# EasyEDA Pro project esp12.eprj

# Schematic Schematic1
Create Date: 2022-09-19; Page Name: P1; Project Name: esp12; Schematic Name: Schematic1; Update Date: 2023-09-01; Company: EasyEDA.com; Drawed: EasyEDA Pro; Page Size: A4; Part Number: JLCPCB-002; Reviewed: EasyEDA Pro; Version: V0.1
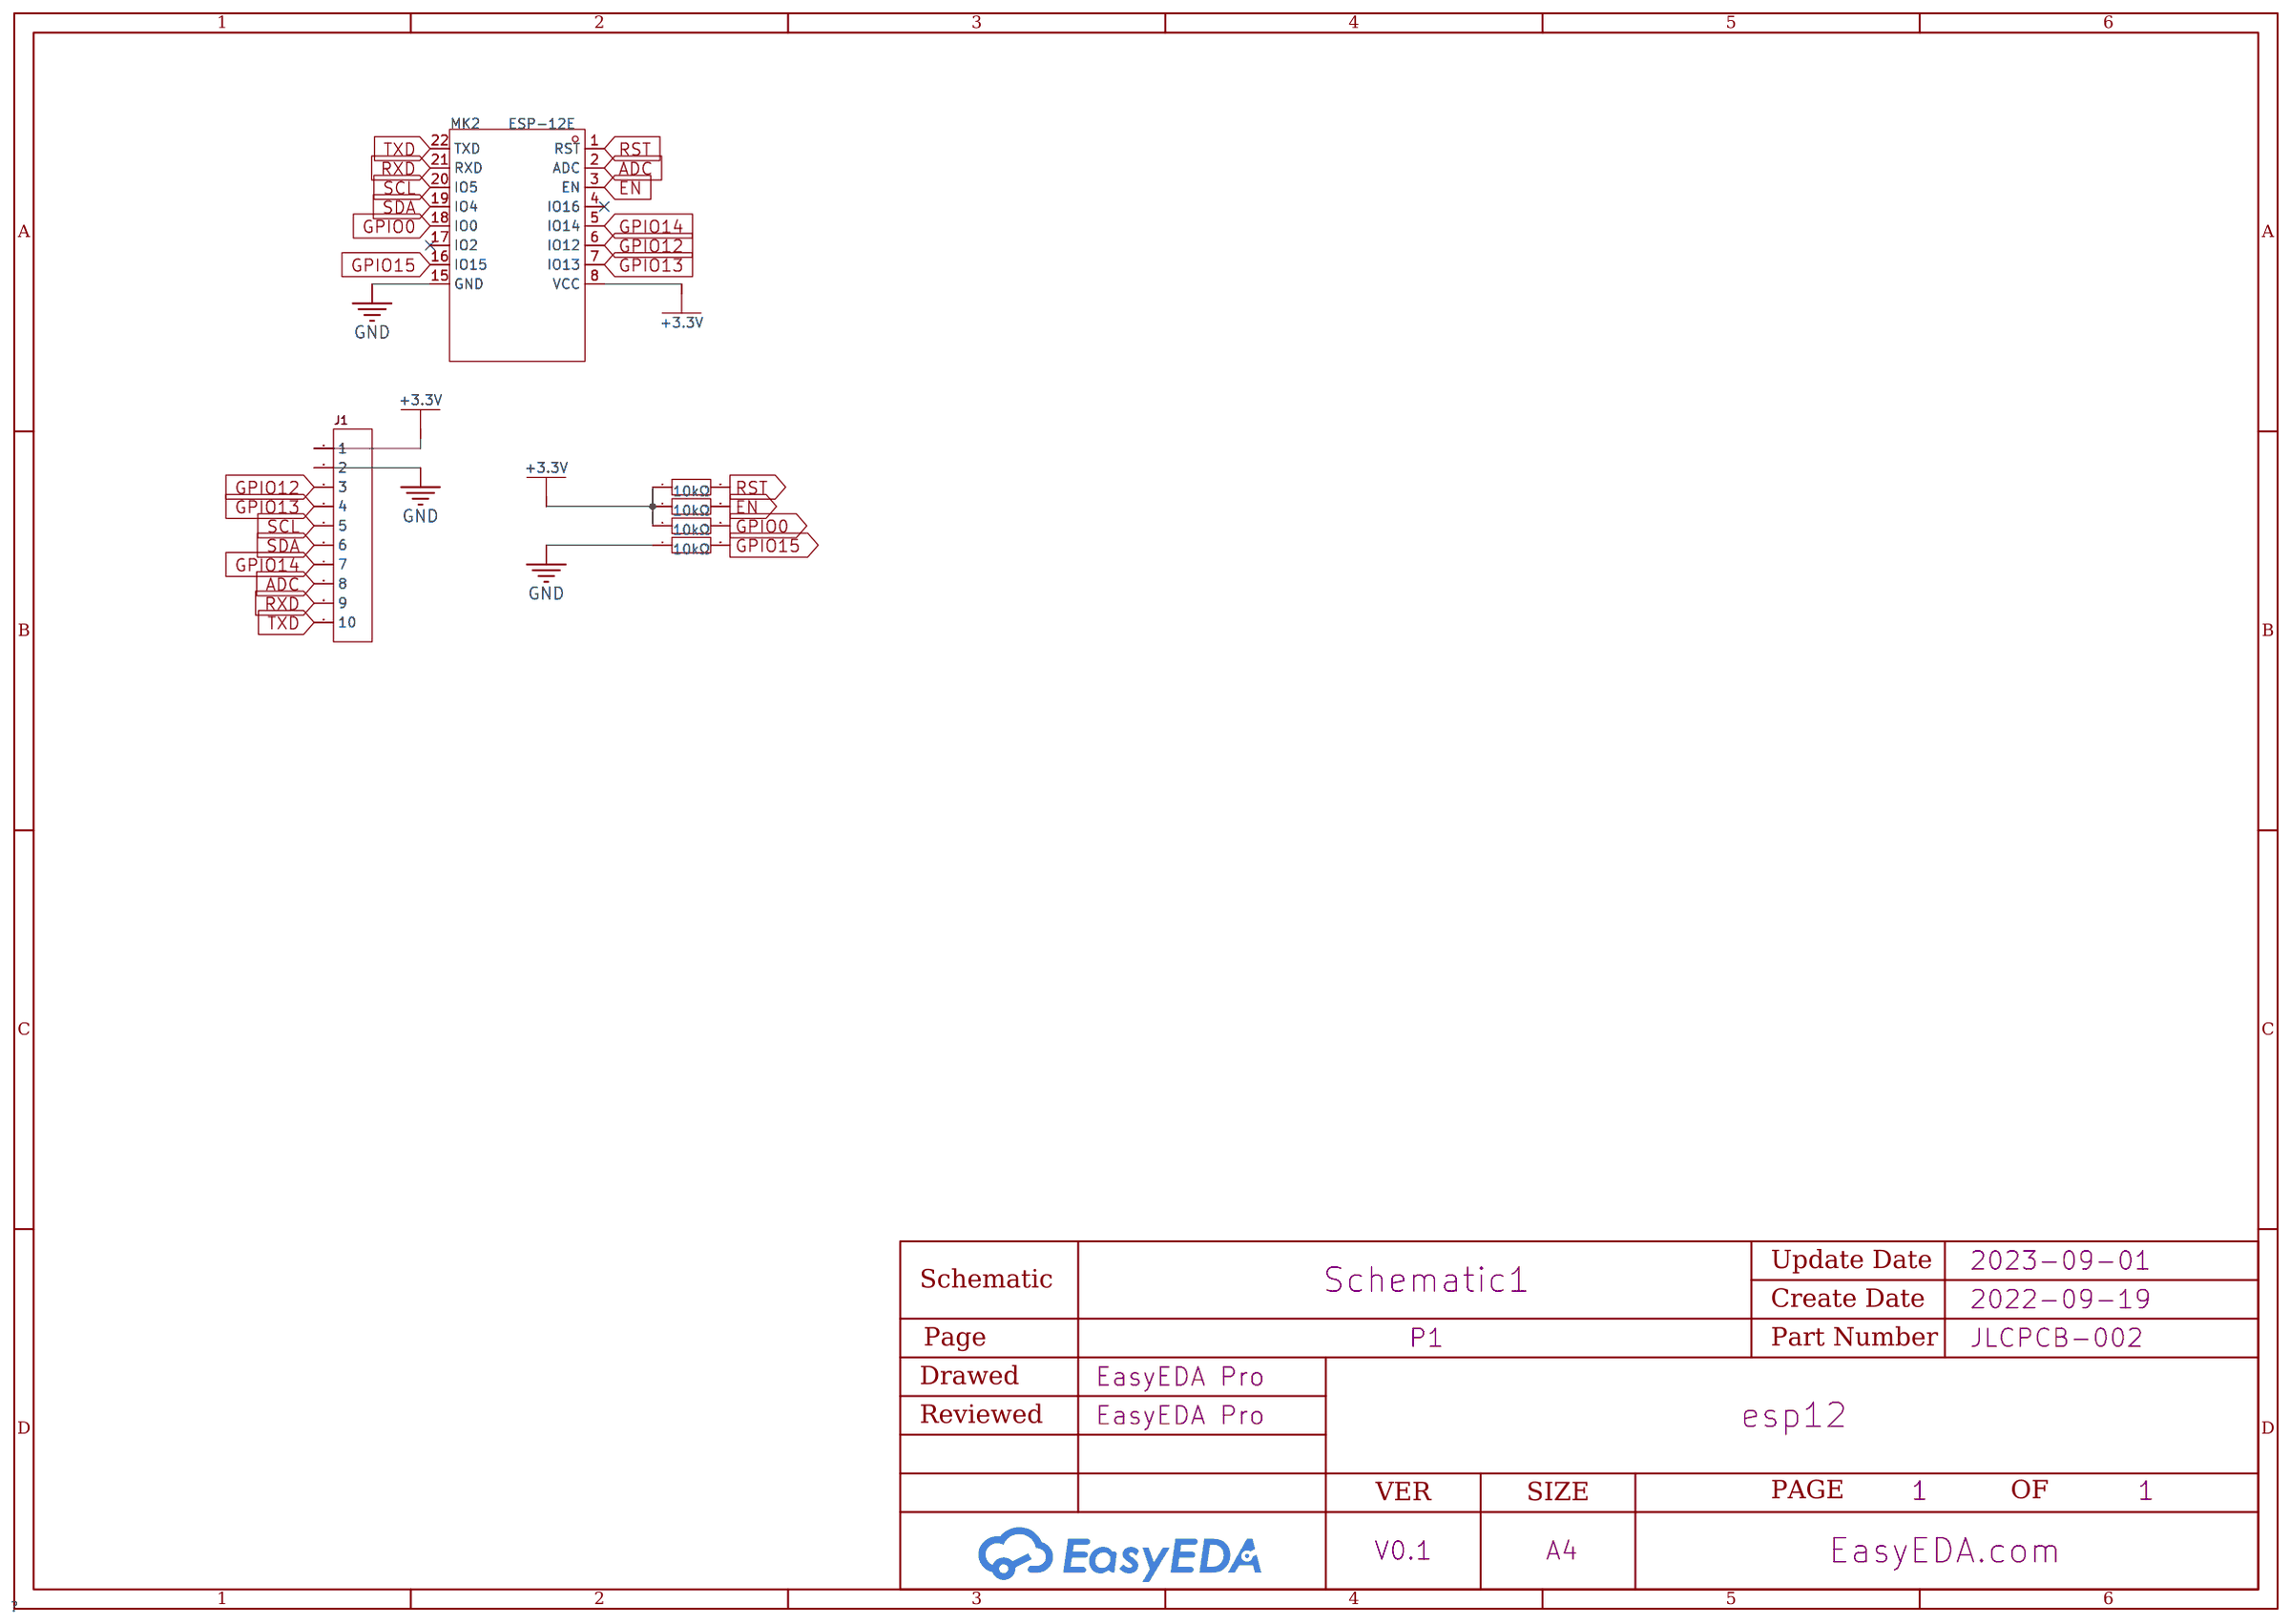
[diagram p0: schematic sheet]

## Parts
J1  HDR-M-2.54_1x10  [HDR-TH_10P-P2.54-V-F-R2-C5-S2.54-4]
MK2  ESP-12E  [WIFIM-SMD_ESP-12E-BR]
R4  10kΩ  [R0603]
R5  10kΩ  [R0603]
R6  10kΩ  [R0603]
R7  10kΩ  [R0603]

## Library data of the parts
J1 = HDR-M-2.54_1x10: Supplier Part: C57369; Supplier: LCSC
MK2 = ESP-12E_C89297: Supplier Part: C89297; Manufacturer: Ai-Thinker(安信可); Supplier Footprint: 无线模块(WIFI); JLCPCB Part Class: Extended Part; Datasheet: https://atta.szlcsc.com/upload/public/pdf/source/20161125/1480068346912.pdf; Supplier: LCSC
R4-R7 = RC0603JR-0710KL: Overload Voltage (Max): Resistance: Body Length:- Tolerance: φD:- Body Height:- Body Width:- Type:Thick Film Resistors Temperature Coefficient: Temperature Coefficient: Operating Temperature Range: Operating Temperature Range: Power(Watts):; LCSC Part Name: 10kΩ ±5%; Supplier Part: C99198; Manufacturer: YAGEO(国巨); Supplier Footprint: 0603; JLCPCB Part Class: Extended Part; Datasheet: https://atta.szlcsc.com/upload/public/pdf/source/20181223/C99198_917934A193F41F77D9F7D214A8C79116.pdf; Supplier: LCSC; Type: Thick Film Resistors

## Nets
+3.3V: J1.1 MK2.8(VCC) R4.1 R5.1 R6.1
GND: J1.2 MK2.15(GND) R7.1
ADC: J1.8 MK2.2(ADC)
EN: MK2.3(EN) R6.2
GPIO0: MK2.18(IO0) R4.2
GPIO12: J1.3 MK2.6(IO12)
GPIO13: J1.4 MK2.7(IO13)
GPIO14: J1.7 MK2.5(IO14)
GPIO15: MK2.16(IO15) R7.2
RST: MK2.1(RST) R5.2
RXD: J1.9 MK2.21(RXD)
SCL: J1.5 MK2.20(IO5)
SDA: J1.6 MK2.19(IO4)
TXD: J1.10 MK2.22(TXD)

Not connected (* = marked no-connect by the designer): MK2 4(IO16)* 17(IO2)*

# Schematic Schematic3
Create Date: 2022-12-06; Page Name: P1; Project Name: esp12; Schematic Name: Schematic3; Update Date: 2023-01-08; Company: EasyEDA.com; Drawed: EasyEDA Pro; Page Size: A4; Part Number: JLCPCB-002; Reviewed: EasyEDA Pro; Version: V0.1
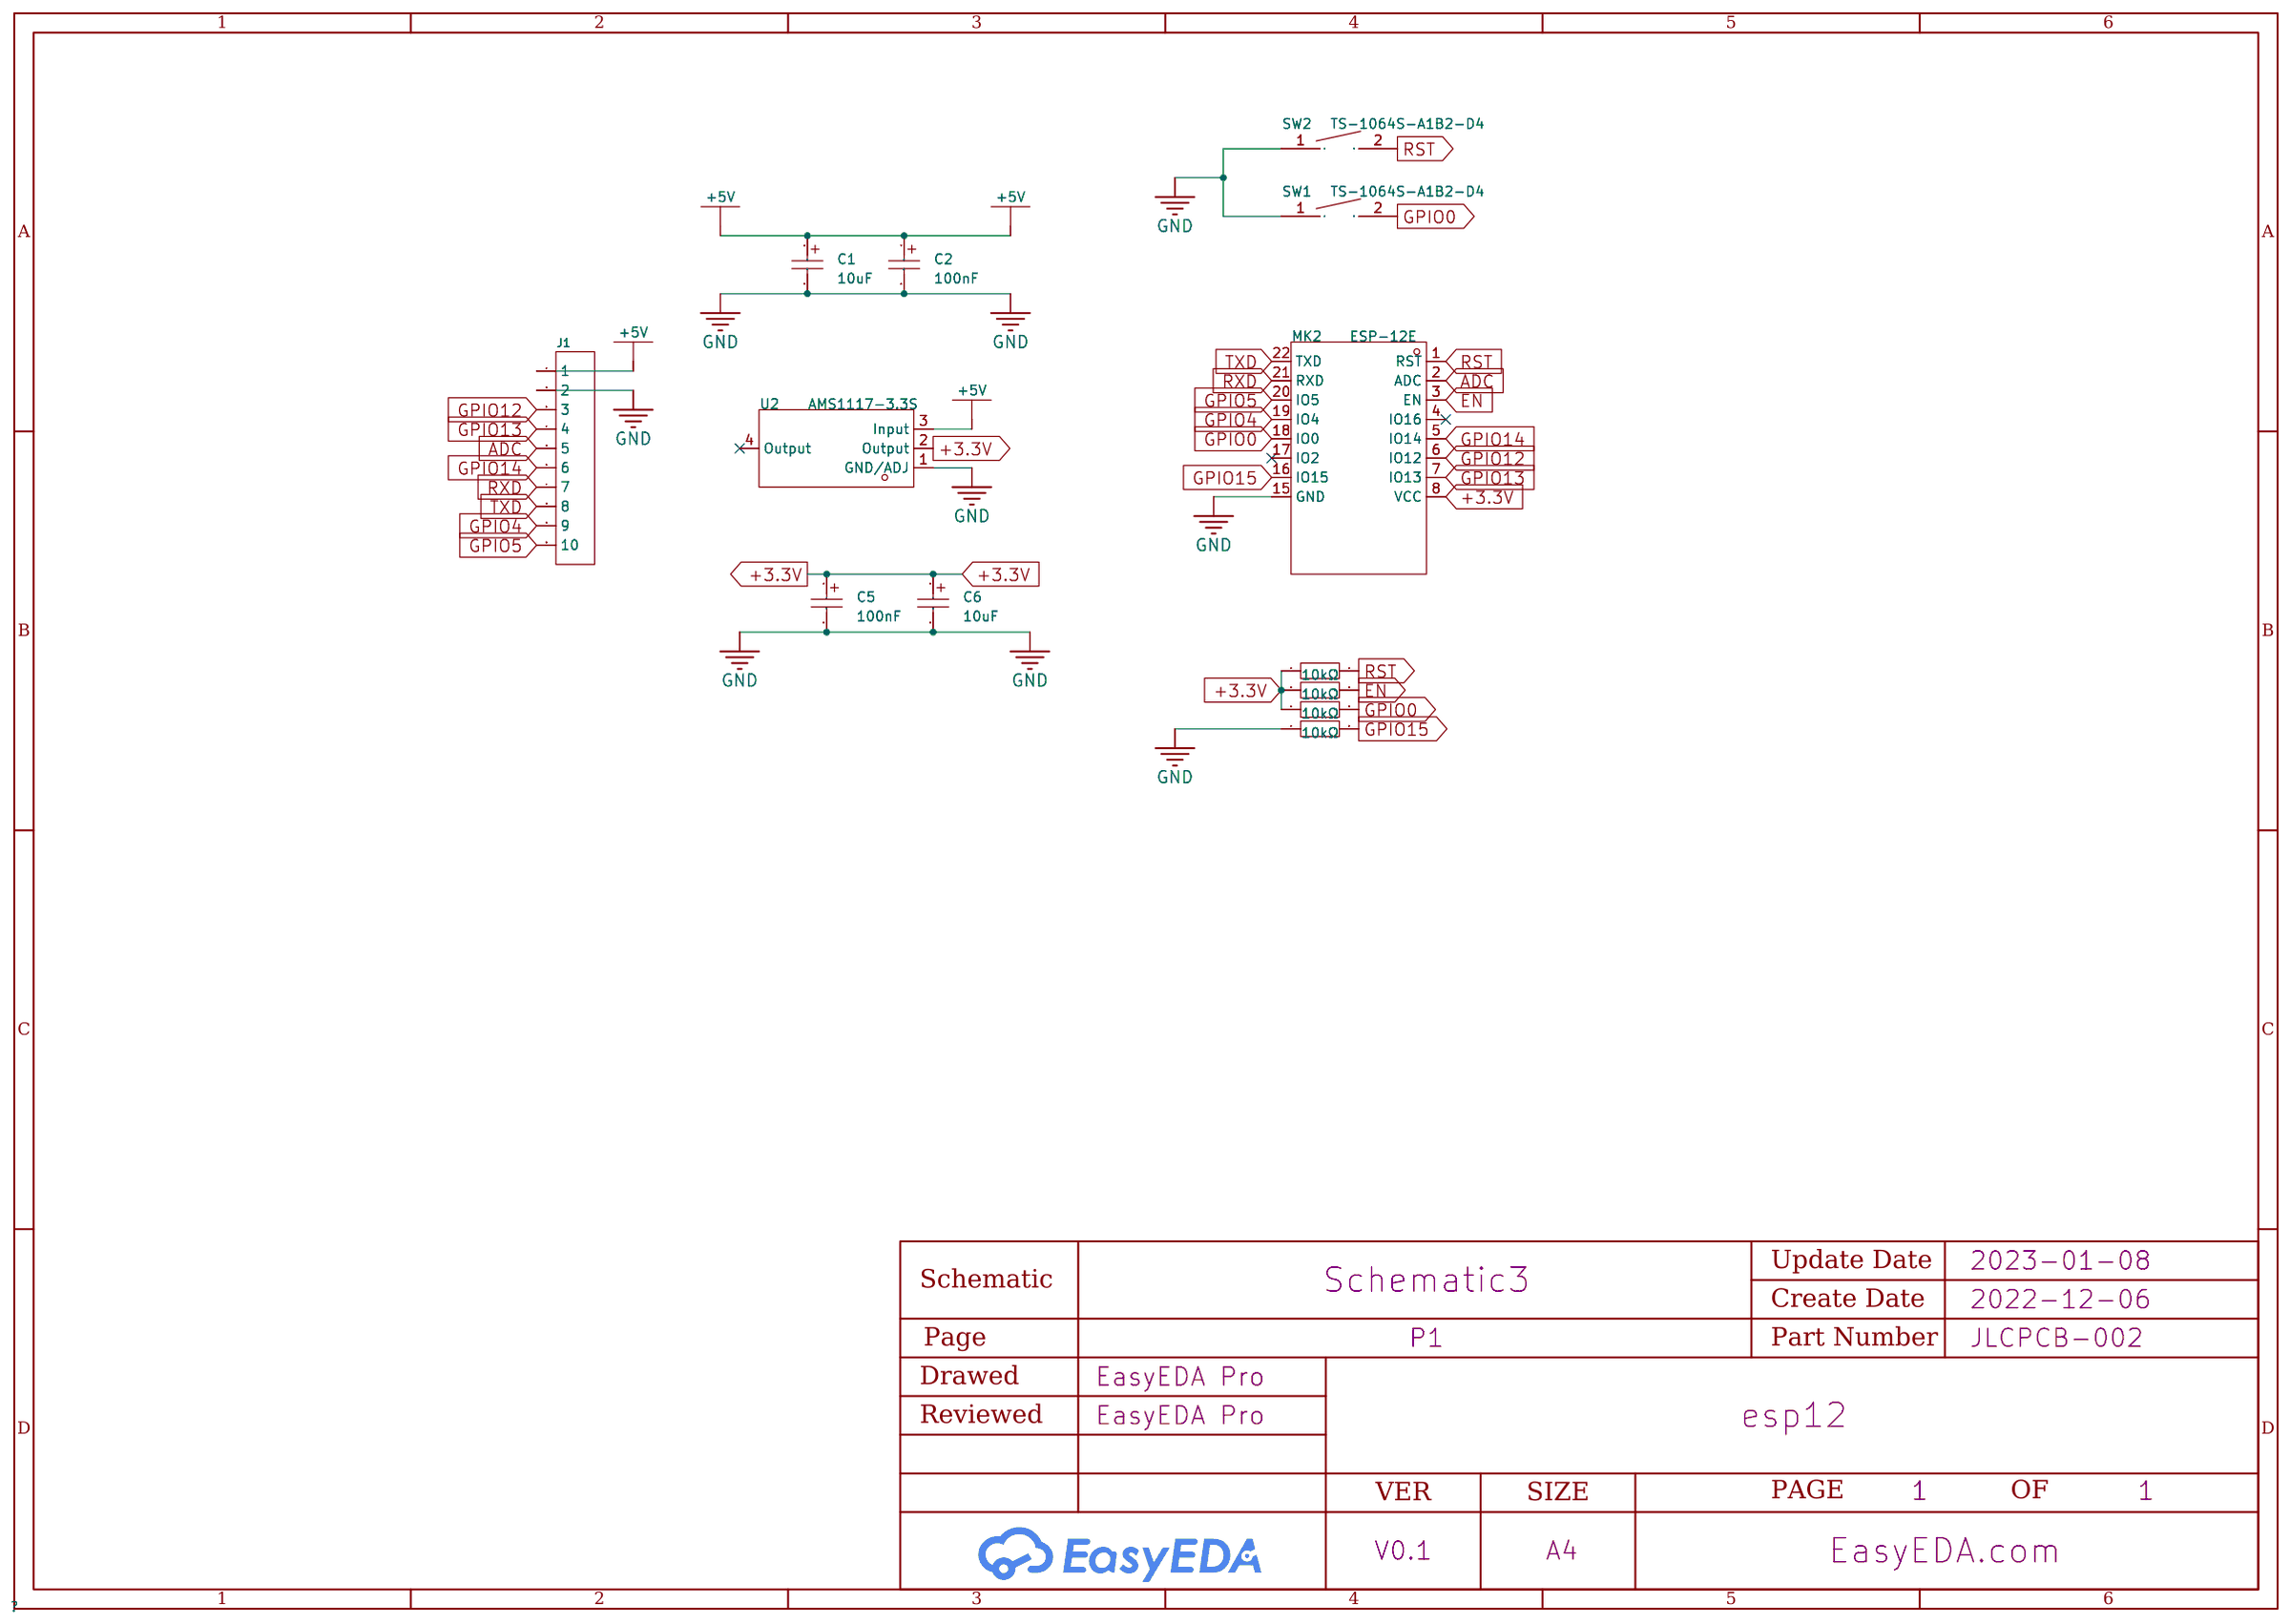
[diagram p1: schematic sheet]

## Parts
C1  10uF  [CAP-SMD_L3.2-W1.6-RD]
C2  100nF  [CAP-SMD_L3.2-W1.6]
C5  100nF  [CAP-SMD_L3.2-W1.6]
C6  10uF  [CAP-SMD_L3.2-W1.6-RD]
J1  HDR-M-2.54_1x10  [HDR-TH_10P-P2.54-V-F-R2-C5-S2.54-4]
MK2  ESP-12E  [WIFIM-SMD_ESP-12E-BR]
R1  10kΩ  [R0603]
R2  10kΩ  [R0603]
R3  10kΩ  [R0603]
R4  10kΩ  [R0603]
SW1  TS-1064S-A1B2-D4  [KEY-SMD_L3.0-W2.5-LS4.0]
SW2  TS-1064S-A1B2-D4  [KEY-SMD_L3.0-W2.5-LS4.0]
U2  AMS1117-3.3S  [SOT-223-4_L6.5-W3.5-P2.30-LS7.0-BL]

## Library data of the parts
C1 C6 = TAJA106K010RNJ: Capacitance: Tolerance:±10% Tolerance:±10% Rated Voltage: Equivalent Series Resistance(ESR):3Ω@100kHz Operating Temperature:-55~+125 Operating Temperature:-55~+125; LCSC Part Name: 10uF ±10% 10V; Supplier Part: C7177; Manufacturer: Kyocera AVX; Supplier Footprint: CASE-A_3216; JLCPCB Part Class: Extended Part; Datasheet: https://atta.szlcsc.com/upload/public/pdf/source/20160107/1457707748330.pdf; Supplier: LCSC; Tolerance: ±10%; Equivalent Series Resistance(ESR): 3Ω@100kHz; Operating Temperature: -55~+125
C2 C5 = TAJA104K035RNJ: Capacitance: Tolerance:±10% Tolerance:±10% Rated Voltage: Equivalent Series Resistance(ESR):24Ω@100kHz Operating Temperature:-55~+125 Operating Temperature:-55~+125; LCSC Part Name: 100nF ±10% 35V; Supplier Part: C7173; Manufacturer: Kyocera AVX; Supplier Footprint: CASE-A_3216; JLCPCB Part Class: Extended Part; Datasheet: https://atta.szlcsc.com/upload/public/pdf/source/20160107/1457707748183.pdf; Supplier: LCSC; Tolerance: ±10%; Equivalent Series Resistance(ESR): 24Ω@100kHz; Operating Temperature: -55~+125
J1 = HDR-M-2.54_1x10: Supplier Part: C57369; Supplier: LCSC
MK2 = ESP-12E_C89297: Supplier Part: C89297; Manufacturer: Ai-Thinker(安信可); Supplier Footprint: 无线模块(WIFI); JLCPCB Part Class: Extended Part; Datasheet: https://atta.szlcsc.com/upload/public/pdf/source/20161125/1480068346912.pdf; Supplier: LCSC
R1-R4 = RC0603JR-0710KL: Overload Voltage (Max): Resistance: Body Length:- Tolerance: φD:- Body Height:- Body Width:- Type:Thick Film Resistors Temperature Coefficient: Temperature Coefficient: Operating Temperature Range: Operating Temperature Range: Power(Watts):; LCSC Part Name: 10kΩ ±5%; Supplier Part: C99198; Manufacturer: YAGEO(国巨); Supplier Footprint: 0603; JLCPCB Part Class: Extended Part; Datasheet: https://atta.szlcsc.com/upload/public/pdf/source/20181223/C99198_917934A193F41F77D9F7D214A8C79116.pdf; Supplier: LCSC; Type: Thick Film Resistors
SW1 SW2 = TS-1064S-A1B2-D4: Circuit:SPST Mounting Style:Brick nogging Actuator Style:Round Button With Lamp:- Operating Force:180gf@±30gf Switch Length:3mm Switch Width:2.5mm Switch Height:1.5mm; LCSC Part Name: 轻触开关3.0*2.5*1.5正按贴片小小龟180gf; Supplier Part: C498294; Manufacturer: Yuandi(台湾元迪); Supplier Footprint: SMD,3x2.5x1.5mm; JLCPCB Part Class: Extended Part; Datasheet: https://atta.szlcsc.com/upload/public/pdf/source/20200318/C498294_666F8F3E87612379939888B0D532704B.pdf; Supplier: LCSC; Circuit: SPST; Mounting Style: Brick nogging; Actuator Style: Round Button; Operating Force: 180gf@±30gf; Switch Length: 3mm; Switch Width: 2.5mm; Switch Height: 1.5mm
U2 = AMS1117-3.3S: Supplier Part: C2842296; Manufacturer: KEXIN(科信); Supplier Footprint: SOT-223; JLCPCB Part Class: Extended Part; Datasheet: https://atta.szlcsc.com/upload/public/pdf/source/20220119/687E7B65F4F54F278E2F75AE3BEEDBF9.pdf; Supplier: LCSC

## Nets
+3.3V: C5.1 C6.1 MK2.8(VCC) R1.1 R2.1 R4.1 U2.2(Output)
+5V: C1.1 C2.1 J1.1 U2.3(Input)
GND: C1.2 C2.2 C5.2 C6.2 J1.2 MK2.15(GND) R3.1 SW1.1 SW2.1 U2.1(GND/ADJ)
ADC: J1.5 MK2.2(ADC)
EN: MK2.3(EN) R2.2
GPIO0: MK2.18(IO0) R4.2 SW1.2
GPIO4: J1.9 MK2.19(IO4)
GPIO5: J1.10 MK2.20(IO5)
GPIO12: J1.3 MK2.6(IO12)
GPIO13: J1.4 MK2.7(IO13)
GPIO14: J1.6 MK2.5(IO14)
GPIO15: MK2.16(IO15) R3.2
RST: MK2.1(RST) R1.2 SW2.2
RXD: J1.7 MK2.21(RXD)
TXD: J1.8 MK2.22(TXD)

Not connected (* = marked no-connect by the designer): MK2 4(IO16)* 17(IO2)*; U2 4(Output)*

# Schematic Schematic2
Create Date: 2022-12-06; Page Name: P1; Project Name: esp12; Schematic Name: Schematic2; Update Date: 2023-01-06; Company: EasyEDA.com; Drawed: EasyEDA Pro; Page Size: A4; Part Number: JLCPCB-002; Reviewed: EasyEDA Pro; Version: V0.1
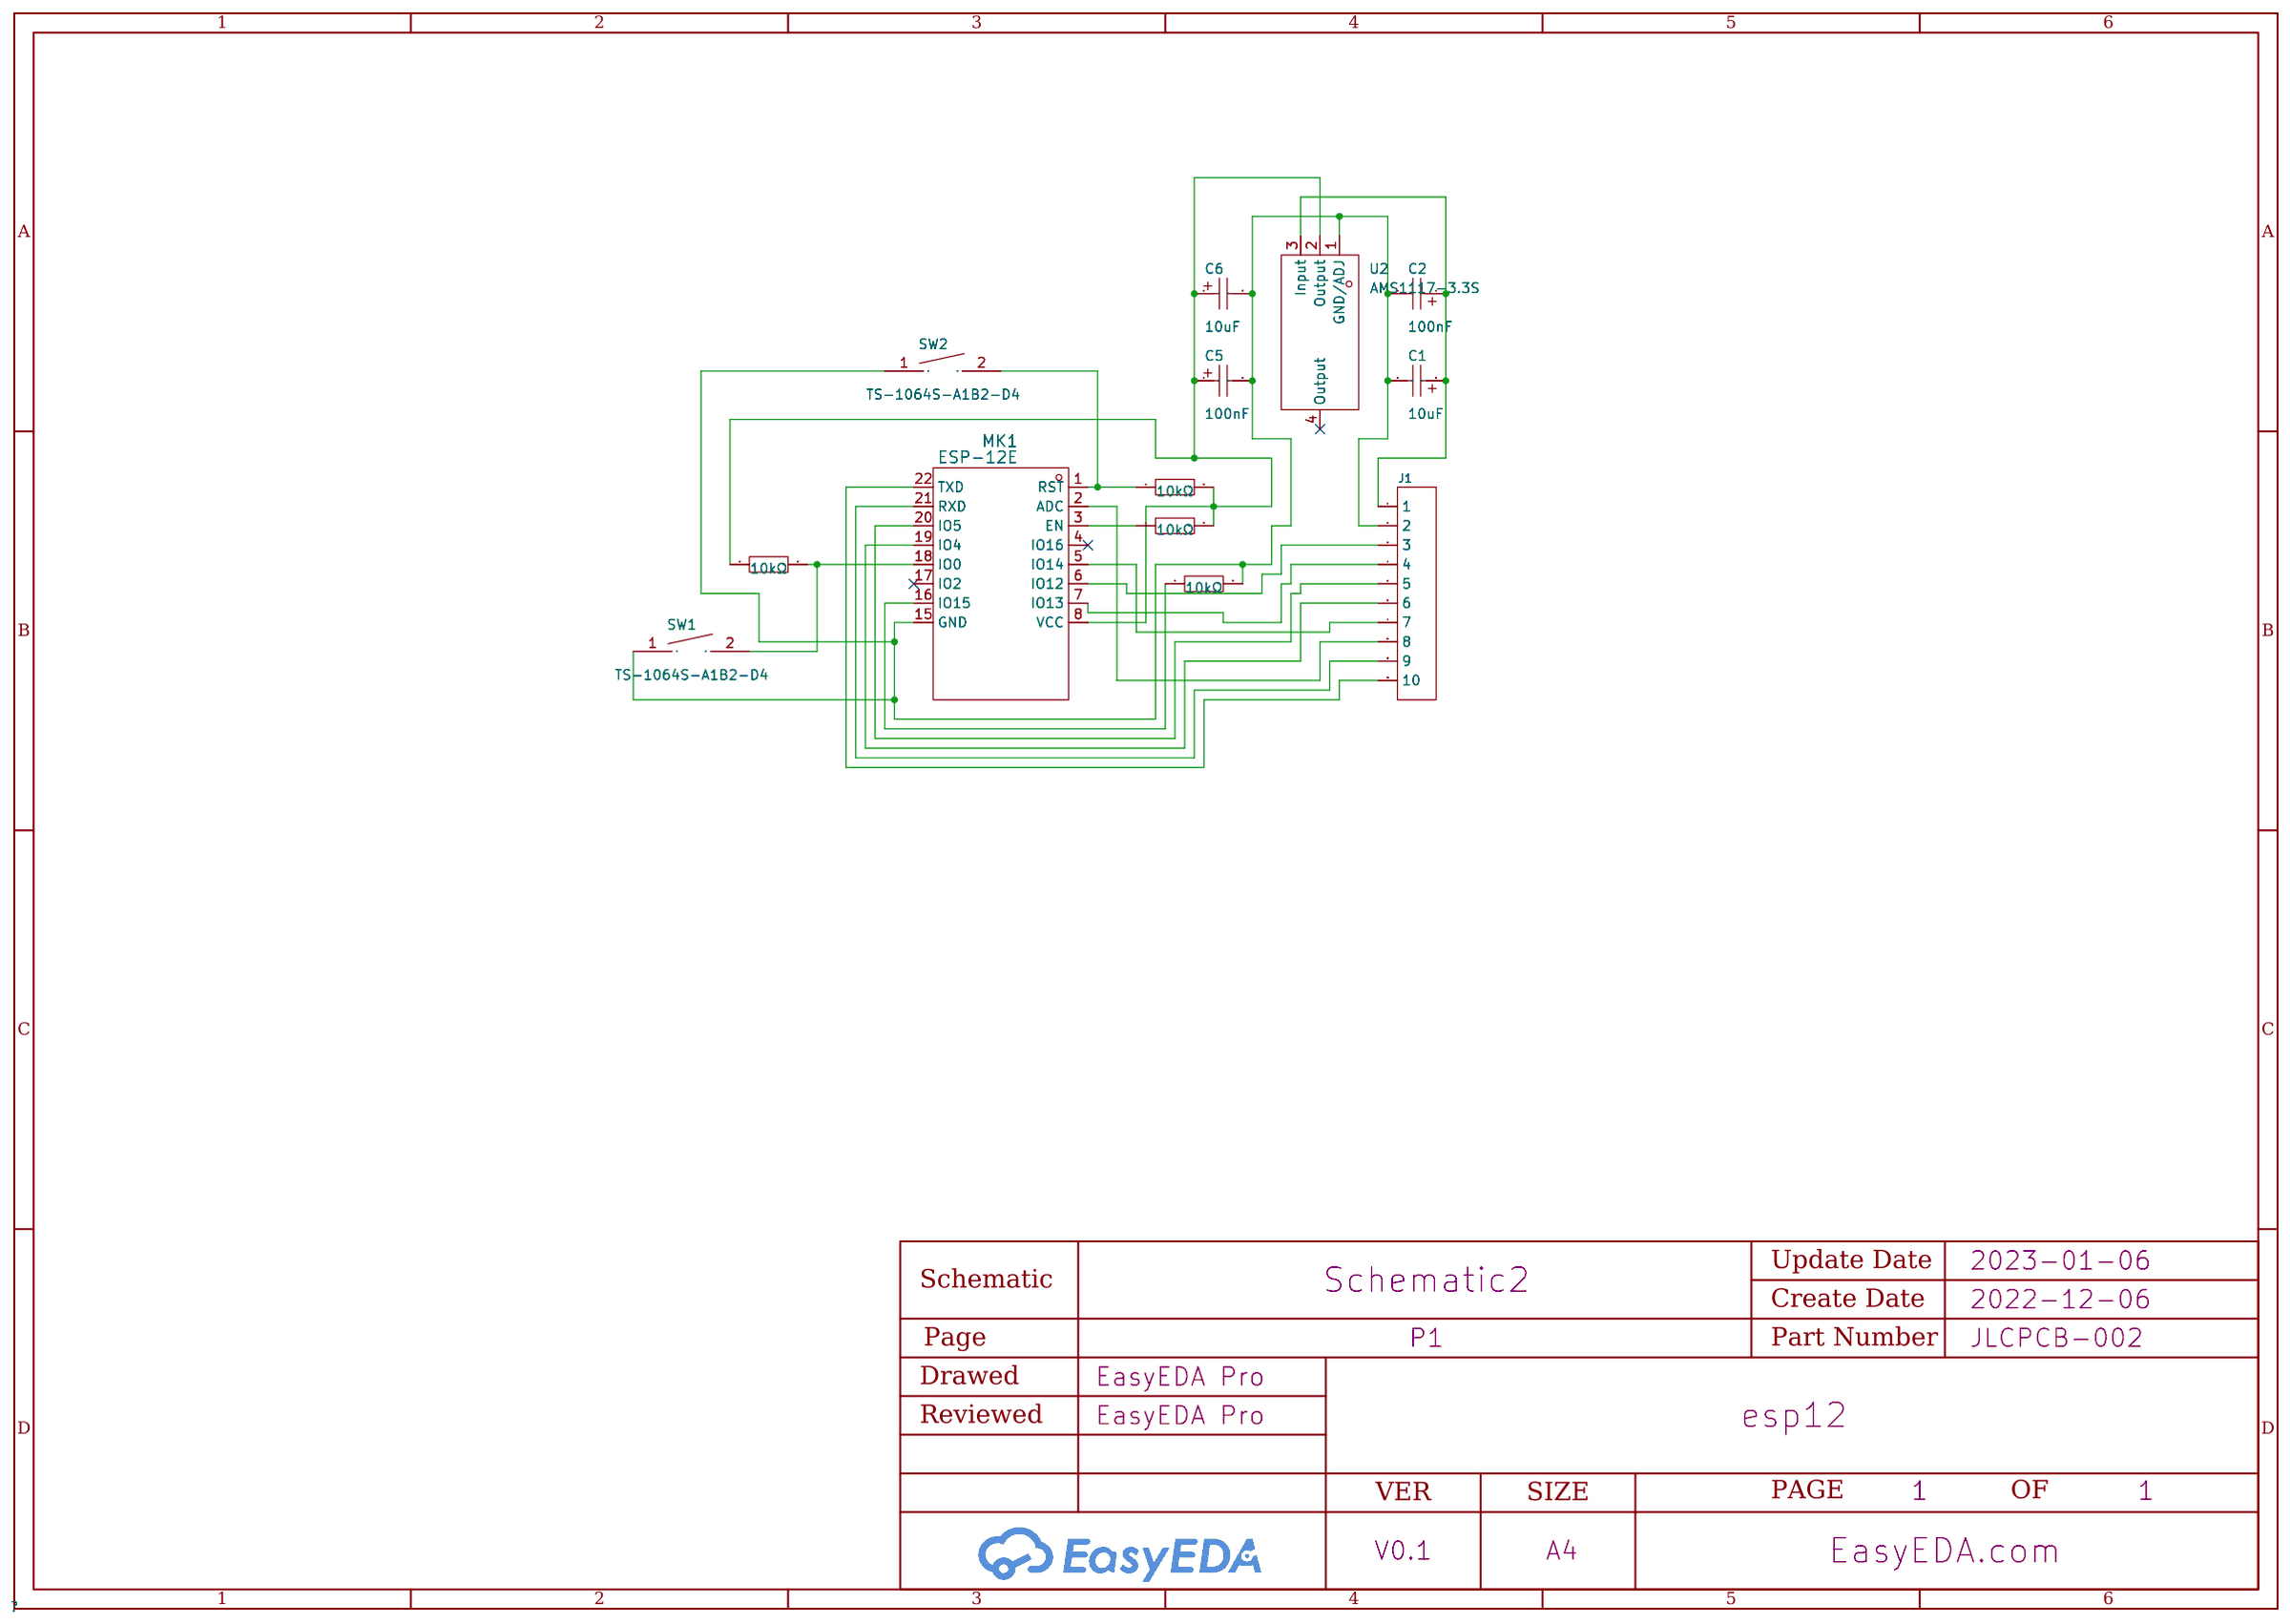
[diagram p2: schematic sheet]

## Parts
C1  10uF  [CAP-SMD_L3.2-W1.6-RD]
C2  100nF  [CAP-SMD_L3.2-W1.6]
C5  100nF  [CAP-SMD_L3.2-W1.6]
C6  10uF  [CAP-SMD_L3.2-W1.6-RD]
J1  HDR-M-2.54_1x10  [HDR-TH_10P-P2.54-V-F-R2-C5-S2.54-4]
MK1  ESP-12E  [WIFIM-SMD_ESP-12E]
R1  10kΩ  [R0603]
R2  10kΩ  [R0603]
R3  10kΩ  [R0603]
R4  10kΩ  [R0603]
SW1  TS-1064S-A1B2-D4  [KEY-SMD_L3.0-W2.5-LS4.0]
SW2  TS-1064S-A1B2-D4  [KEY-SMD_L3.0-W2.5-LS4.0]
U2  AMS1117-3.3S  [SOT-223-4_L6.5-W3.5-P2.30-LS7.0-BL]

## Library data of the parts
C1 C6 = TAJA106K010RNJ: Capacitance: Tolerance:±10% Tolerance:±10% Rated Voltage: Equivalent Series Resistance(ESR):3Ω@100kHz Operating Temperature:-55~+125 Operating Temperature:-55~+125; LCSC Part Name: 10uF ±10% 10V; Supplier Part: C7177; Manufacturer: Kyocera AVX; Supplier Footprint: CASE-A_3216; JLCPCB Part Class: Extended Part; Datasheet: https://atta.szlcsc.com/upload/public/pdf/source/20160107/1457707748330.pdf; Supplier: LCSC; Tolerance: ±10%; Equivalent Series Resistance(ESR): 3Ω@100kHz; Operating Temperature: -55~+125
C2 C5 = TAJA104K035RNJ: Capacitance: Tolerance:±10% Tolerance:±10% Rated Voltage: Equivalent Series Resistance(ESR):24Ω@100kHz Operating Temperature:-55~+125 Operating Temperature:-55~+125; LCSC Part Name: 100nF ±10% 35V; Supplier Part: C7173; Manufacturer: Kyocera AVX; Supplier Footprint: CASE-A_3216; JLCPCB Part Class: Extended Part; Datasheet: https://atta.szlcsc.com/upload/public/pdf/source/20160107/1457707748183.pdf; Supplier: LCSC; Tolerance: ±10%; Equivalent Series Resistance(ESR): 24Ω@100kHz; Operating Temperature: -55~+125
J1 = HDR-M-2.54_1x10: Supplier Part: C57369; Supplier: LCSC
MK1 = ESP-12E: Supplier: LCSC; Manufacturer: Ai-Thinker; Supplier Part: C89297; JLCPCB Part Class: Extended Part; NO_CONNECT: yes
R1-R4 = RC0603JR-0710KL: Overload Voltage (Max): Resistance: Body Length:- Tolerance: φD:- Body Height:- Body Width:- Type:Thick Film Resistors Temperature Coefficient: Temperature Coefficient: Operating Temperature Range: Operating Temperature Range: Power(Watts):; LCSC Part Name: 10kΩ ±5%; Supplier Part: C99198; Manufacturer: YAGEO(国巨); Supplier Footprint: 0603; JLCPCB Part Class: Extended Part; Datasheet: https://atta.szlcsc.com/upload/public/pdf/source/20181223/C99198_917934A193F41F77D9F7D214A8C79116.pdf; Supplier: LCSC; Type: Thick Film Resistors
SW1 SW2 = TS-1064S-A1B2-D4: Circuit:SPST Mounting Style:Brick nogging Actuator Style:Round Button With Lamp:- Operating Force:180gf@±30gf Switch Length:3mm Switch Width:2.5mm Switch Height:1.5mm; LCSC Part Name: 轻触开关3.0*2.5*1.5正按贴片小小龟180gf; Supplier Part: C498294; Manufacturer: Yuandi(台湾元迪); Supplier Footprint: SMD,3x2.5x1.5mm; JLCPCB Part Class: Extended Part; Datasheet: https://atta.szlcsc.com/upload/public/pdf/source/20200318/C498294_666F8F3E87612379939888B0D532704B.pdf; Supplier: LCSC; Circuit: SPST; Mounting Style: Brick nogging; Actuator Style: Round Button; Operating Force: 180gf@±30gf; Switch Length: 3mm; Switch Width: 2.5mm; Switch Height: 1.5mm
U2 = AMS1117-3.3S: Supplier Part: C2842296; Manufacturer: KEXIN(科信); Supplier Footprint: SOT-223; JLCPCB Part Class: Extended Part; Datasheet: https://atta.szlcsc.com/upload/public/pdf/source/20220119/687E7B65F4F54F278E2F75AE3BEEDBF9.pdf; Supplier: LCSC

## Nets
$1N491: MK1.1(RST) R1.1 SW2.2
$1N492: MK1.16(IO15) R3.1
$1N493: MK1.3(EN) R2.1
$1N496: J1.5 MK1.20(IO5)
$1N497: J1.6 MK1.19(IO4)
$1N498: J1.3 MK1.6(IO12)
$1N499: J1.4 MK1.7(IO13)
$1N500: J1.8 MK1.2(ADC)
$1N502: J1.9 MK1.21(RXD)
$1N503: J1.10 MK1.22(TXD)
$1N1406: C1.2 C2.2 C5.2 C6.2 J1.2 MK1.15(GND) R3.2 SW1.1 SW2.1 U2.1(GND/ADJ)
$1N1442: C5.1 C6.1 MK1.8(VCC) R1.2 R2.2 R4.1 U2.2(Output)
$1N1456: C1.1 C2.1 J1.1 U2.3(Input)
$1N1746: MK1.18(IO0) R4.2 SW1.2
Net-(J1-7): J1.7 MK1.5(IO14)

Not connected (* = marked no-connect by the designer): MK1 4(IO16)* 17(IO2)*; U2 4(Output)*

# Board PCB1
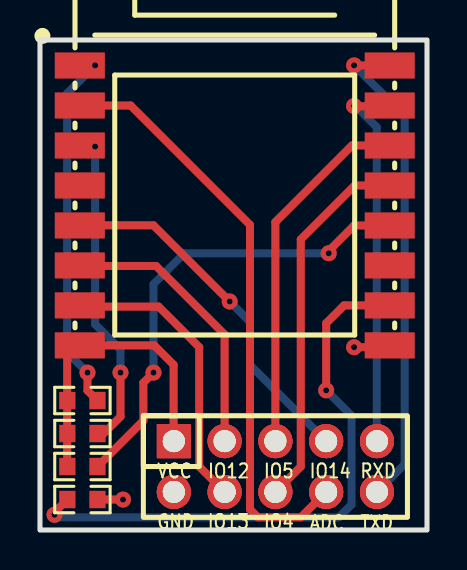
[diagram p3: board, top side]
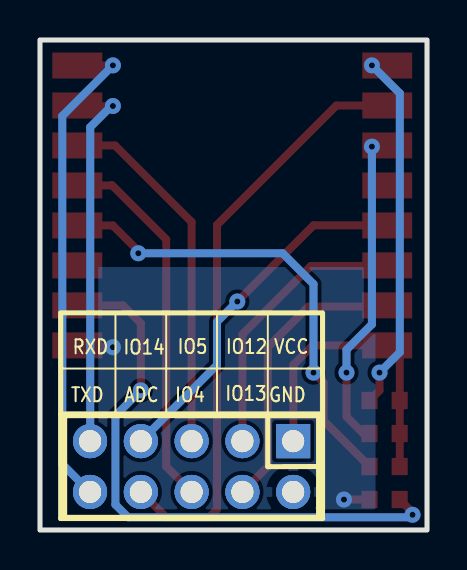
[diagram p4: board, bottom side, seen from below]

Outline 19.36 x 24.51 mm; copper layers: Top Layer, Bottom Layer. Coordinates in mm from the lower left corner of the outline.
Outline path: rectangle 0,24.51 19.36,0
Stack: Top Layer 0.035mm / Dielectric1 1.51mm FR4 er 4.5 / Bottom Layer 0.035mm

## Design rules (mm)
spacing safeClearance (default): track to track 0.152, other pairs 0.152 to 0.3
track width trackWidth (default): min 0.127, default 0.254, max 2.54
differential pair differentialPair (default): width min 0.127, default 0.254, max 2.54; gap min 0.152, default 0.152
via viaSize (default): diameter min 0.5, default 0.61, max 10; hole min 0.3, default 0.305, max 6

## Placement (name value [footprint] x y rotation side)
H1  DS1023-2*5SF11  [HDR-TH_10P-P2.54-V-F-R2-C5-S2.54]  11.77 3.17 0 top
H2  PZ254-2-05-Z-8.5  [HDR-TH_10P-P2.54-V-M-R2-C5-S2.54]  11.77 3.17 0 bottom
J1  HDR-M-2.54_1x10  [HDR-TH_10P-P2.54-V-F-R2-C5-S2.54-4]  11.77 3.17 0 bottom
MK2  ESP-12E  [WIFIM-SMD_ESP-12E-BR]  9.74 15.49 270 top
R4  10kΩ  [R0603]  2.12 3.17 0 top
R5  10kΩ  [R0603]  2.12 6.48 0 top
R6  10kΩ  [R0603]  2.12 4.83 0 top
R7  10kΩ  [R0603]  2.12 1.52 180 top

## Footprints (pads in the part's own frame, mm; a bottom-side part is the same pattern mirrored in y, then rotated)
HDR-TH_10P-P2.54-V-F-R2-C5-S2.54
  rect 1.575x1.7 hole 1.1: 1(-5.08,1.27)
  round 1.7 hole 1.1: 2(-5.08,-1.27) 3(-2.54,1.27) 4(-2.54,-1.27) 5(0,1.27) 6(0,-1.27) 7(2.54,1.27) 8(2.54,-1.27) 9(5.08,1.27) 10(5.08,-1.27)
HDR-TH_10P-P2.54-V-F-R2-C5-S2.54-4
  rect 1.7x1.7 hole 1.05: 1(-5.08,-1.27)
  round 1.7 hole 1.05: 2(-5.08,1.27) 3(-2.54,-1.27) 4(-2.54,1.27) 5(0,-1.27) 6(0,1.27) 7(2.54,-1.27) 8(2.54,1.27) 9(5.08,-1.27) 10(5.08,1.27)
HDR-TH_10P-P2.54-V-M-R2-C5-S2.54
  rect 1.7x1.7 hole 1.1: 1(-5.08,-1.27)
  round 1.7 hole 1.1: 2(-5.08,1.27) 3(-2.54,-1.27) 4(-2.54,1.27) 5(0,-1.27) 6(0,1.27) 7(2.54,-1.27) 8(2.54,1.27) 9(5.08,-1.27) 10(5.08,1.27)
R0603
  rect 0.806x0.864 smd: 1(-0.753,0) 2(0.753,0)
WIFIM-SMD_ESP-12E-BR
  rect 1.3x2.5 smd: 1(-7.74,-7.75) 2(-5.74,-7.75) 3(-3.74,-7.75) 4(-1.74,-7.75) 5(0.26,-7.75) 6(2.26,-7.75) 7(4.26,-7.75) 8(6.26,-7.75) 15(6.26,7.75) 16(4.26,7.75) 17(2.26,7.75) 18(0.26,7.75) 19(-1.74,7.75) 20(-3.74,7.75) 21(-5.74,7.75) 22(-7.74,7.75)

## Nets
As in the schematic.

Pads without a net: H1 1 2 3 4 5 6 7 8 9 10; H2 1 2 3 4 5 6 7 8 9 10; MK2 4 17

## Via types
v1: diameter 0.8, hole 0.305, Top Layer to Bottom Layer, 13 vias

## Routing (per net, layer and track width the routed paths; a pad name or vN(x,y) marks a point on that pad's centre or on a via; arc(x,y) is an arc through that point)
+3.3V: length 15.3
  Top Layer w0.4: R4.1 1.36,3.18 1.36,8.76 1.83,9.23 5.72,9.23 6.69,8.26 6.69,4.45 J1.1
GND: length 3.2
  Top Layer w0.4: v1(4.15,1.52) R7.1 ; v1(15.71,9.14) 17.53,9.14 17.62,9.23
ADC: length 29.7
  Top Layer w0.4: J1.8 13.04,0.63 10.9,0.63 10.5,1.03 10.5,15.26 4.53,21.23 MK2.2
EN: length 16.1
  Top Layer w0.4: v1(4.03,7.87) 4.03,5.67 3.05,4.7 ; 2.12,19.23 2.18,19.18 2.76,19.18
  Bottom Layer w0.4: v1(2.76,19.18) 2.76,10.29 4.03,9.02 v1(4.03,7.87)
GPIO0: length 23.4
  Top Layer w0.4: MK2.18 15.71,15.23 14.44,13.96 v1(14.44,13.84) ; v1(5.68,7.87) 5.17,7.37 5.17,5.47 R4.2
  Bottom Layer w0.4: v1(14.44,13.84) 7.22,13.84 5.68,12.3 v1(5.68,7.87)
GPIO12: length 13.9
  Top Layer w0.4: J1.3 9.23,9.78 5.81,13.21 2.15,13.21 2.12,13.23
GPIO13: length 14.5
  Top Layer w0.4: J1.4 7.96,3.17 7.96,9.14 5.93,11.18 2.18,11.18 2.12,11.23
GPIO14: length 17.9
  Top Layer w0.4: v1(9.49,11.43) 5.68,15.24 2.17,15.24
  Bottom Layer w0.4: J1.7 10.5,8.25 10.5,10.41 v1(9.49,11.43)
GPIO15: length 29.5
  Top Layer w0.4: v1(14.31,6.98) 14.31,10.34 15.21,11.23 MK2.16 ; 17.56,11.18 17.62,11.23 ; v1(0.73,0.76) 0.73,0.88 R7.2 ; 17.49,11.3 17.56,11.23
  Bottom Layer w0.4: v1(0.73,0.76) 0.85,0.63 14.95,0.63 15.58,1.27 15.58,5.72 v1(14.31,6.98)
RST: length 18.6
  Top Layer w0.4: 2.12,23.23 2.75,23.23 v1(2.76,23.24) ; v1(2.38,7.87) 2.38,6.98 R5.2
  Bottom Layer w0.4: v1(2.76,23.24) 1.36,21.84 1.36,8.89 v1(2.38,7.87)
RXD: length 19
  Top Layer w0.4: 15.8,21.2 17.59,21.2
  Bottom Layer w0.4: J1.9 16.84,4.45 16.84,20.15 15.8,21.2
  vias: v1(15.71,21.21)
SCL: length 18.4
  Top Layer w0.4: 17.62,19.23 15.6,19.23 11.77,15.41 J1.5
SDA: length 18.9
  Top Layer w0.4: 17.62,17.23 15.77,17.23 15.75,17.25 13.04,14.54 13.04,3.17 J1.6
TXD: length 24.9
  Top Layer w0.4: 17.62,23.23 17.61,23.24 v1(15.71,23.24)
  Bottom Layer w0.4: v1(15.71,23.24) 18.24,20.71 18.24,3.29 J1.10

## Copper pours and planes (outline as drawn; the poured copper is in the pictures)
GND on Bottom Layer: 2.57,13.16 16.99,13.16 16.99,0.73 2.57,0.73

## Text on the board
Bottom Silkscreen Layer: VCC | GND | IO12 | IO13 | IO5 | IO4 | ADC | IO14 | RXD | TXD
Top Silkscreen Layer: VCC | GND | IO13 | IO12 | IO5 | IO4 | IO14 | ADC | RXD | TXD

# Board PCB3
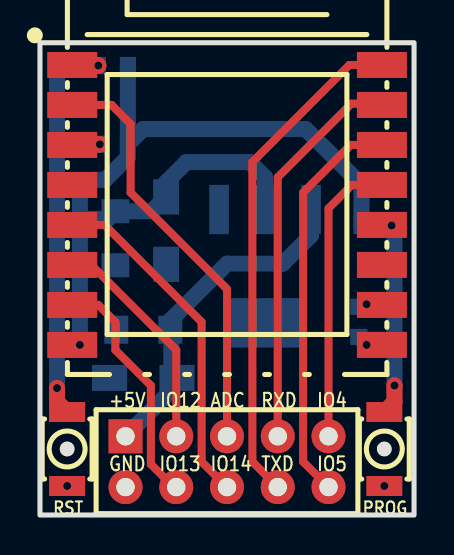
[diagram p5: board, top side]
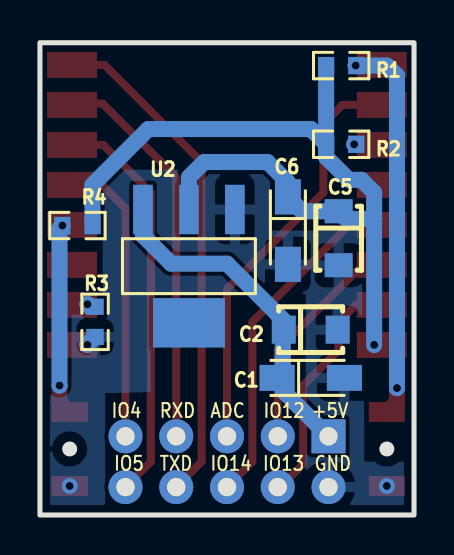
[diagram p6: board, bottom side, seen from below]

Outline 18.72 x 23.62 mm; copper layers: Top Layer, Bottom Layer. Coordinates in mm from the lower left corner of the outline.
Outline path: rectangle 0,23.62 18.72,0
Stack: Top Layer 0.035mm / Dielectric1 1.51mm FR4 er 4.5 / Bottom Layer 0.035mm

## Design rules (mm)
spacing safeClearance (default): track to track 0.152, other pairs 0.152 to 0.3
track width trackWidth (default): min 0.127, default 0.4, max 2.54
differential pair differentialPair (default): width min 0.127, default 0.254, max 2.54; gap min 0.152, default 0.152
via viaSize (default): diameter min 0.5, default 0.8, max 10; hole min 0.3, default 0.4, max 6

## Placement (name value [footprint] x y rotation side)
C1  10uF  [CAP-SMD_L3.2-W1.6-RD]  5.17 6.86 180 bottom
C2  100nF  [CAP-SMD_L3.2-W1.6]  5.17 9.27 180 bottom
C5  100nF  [CAP-SMD_L3.2-W1.6]  3.77 13.84 270 bottom
C6  10uF  [CAP-SMD_L3.2-W1.6-RD]  6.31 14.22 270 bottom
J1  HDR-M-2.54_1x10  [HDR-TH_10P-P2.54-V-F-R2-C5-S2.54-4]  9.36 2.67 0 top
MK2  ESP-12E  [WIFIM-SMD_ESP-12E-BR]  9.25 15.01 270 top
PROG  TS-1064S-A1B2-D4  [KEY-SMD_L3.0-W2.5-LS4.0]  17.24 3.3 90 top
R1  10kΩ  [R0603]  3.65 22.48 180 bottom
R2  10kΩ  [R0603]  3.65 18.54 180 bottom
R3  10kΩ  [R0603]  15.97 9.66 90 bottom
R4  10kΩ  [R0603]  16.85 14.48 0 bottom
RST  TS-1064S-A1B2-D4  [KEY-SMD_L3.0-W2.5-LS4.0]  1.36 3.3 90 top
U2  AMS1117-3.3S  [SOT-223-4_L6.5-W3.5-P2.30-LS7.0-BL]  11.27 12.45 0 bottom

## Footprints (pads in the part's own frame, mm; a bottom-side part is the same pattern mirrored in y, then rotated)
CAP-SMD_L3.2-W1.6
  rect 1.2x1.4 smd: 1(-1.35,0) 2(1.35,0)
CAP-SMD_L3.2-W1.6-RD
  rect 1.758x1.296 smd: 1(-1.687,0) 2(1.687,0)
HDR-TH_10P-P2.54-V-F-R2-C5-S2.54-4
  rect 1.7x1.7 hole 0.914: 1(-5.08,1.27)
  round 1.7 hole 0.914: 2(-5.08,-1.27) 3(-2.54,1.27) 4(-2.54,-1.27) 5(0,1.27) 6(0,-1.27) 7(2.54,1.27) 8(2.54,-1.27) 9(5.08,1.27) 10(5.08,-1.27)
KEY-SMD_L3.0-W2.5-LS4.0
  rect 1x1.8 smd: 1(-1.85,0) 2(1.85,0)
R0603
  rect 0.806x0.864 smd: 1(-0.753,0) 2(0.753,0)
SOT-223-4_L6.5-W3.5-P2.30-LS7.0-BL
  rect 0.98x2.47 smd: 1(-2.3,-2.835) 2(0,-2.835) 3(2.3,-2.835)
  rect 3.6x2.47 smd: 4(0,2.835)
WIFIM-SMD_ESP-12E-BR
  rect 1.3x2.5 smd: 1(-7.5,-7.638) 2(-5.5,-7.638) 3(-3.501,-7.638) 4(-1.5,-7.638) 5(0.499,-7.638) 6(2.499,-7.638) 7(4.5,-7.638) 8(6.5,-7.638) 15(6.5,7.862) 16(4.5,7.862) 17(2.499,7.862) 18(0.499,7.862) 19(-1.5,7.862) 20(-3.501,7.862) 21(-5.5,7.862) 22(-7.5,7.862)

## Nets
As in the schematic, except:
GND: C1.2 C2.2 C5.2 C6.2 J1.2 MK2.15 PROG.1 R3.1 RST.1 U2.1
GPIO0: MK2.18 PROG.2 R4.2
RST: MK2.1 R1.2 RST.2

Pads without a net: MK2 4 17; U2 4

## Via types
v1: diameter 0.8, hole 0.4, Top Layer to Bottom Layer, 10 vias

## Routing (per net, layer and track width the routed paths; a pad name or vN(x,y) marks a point on that pad's centre or on a via; arc(x,y) is an arc through that point)
+3.3V: length 43.7
  Top Layer w0.8: v1(2,8.51) MK2.8
  Bottom Layer w0.8: R2.1 5.16,19.3 13.3,19.3 16.09,16.51 R4.1 ; R2.1 4.4,17.9 3.26,16.76 2.63,16.76 2,16.13 2,14.81 ; R2.1 R1.1 ; 2,14.81 3.39,14.81 C5.1 5.6,15.19 C6.1 6.31,16.64 7.33,17.65 10.5,17.65 11.27,16.89 U2.2 ; 2,14.81 v1(2,8.51)
+5V: length 16.9
  Bottom Layer w0.8: U2.3 13.57,13.98 12.16,12.57 9.36,12.57 6.52,9.73 C2.1 6.57,9.22 6.57,6.22 4.28,3.94
GND: length 0.6
  Bottom Layer w0.8: v1(16.35,8.51) 16.35,8.53 R3.1
  vias: v1(1.36,1.45) v1(17.24,1.45)
ADC: length 20.9
  Top Layer w0.4: MK2.2 3.58,20.51 4.54,19.56 4.54,16.13 9.36,11.3 J1.5
EN: length 1.4
  Top Layer w0.8: v1(3,18.54) 1.65,18.54 MK2.3
GPIO0: length 9.6
  Top Layer w0.8: PROG.2 17.74,5.66 v1(17.74,6.48)
  Bottom Layer w0.8: v1(17.74,6.48) 17.74,14.33 v1(17.6,14.48)
GPIO4: length 14.6
  Top Layer w0.4: J1.9 14.44,15.34 15.61,16.51 MK2.19
GPIO5: length 20.2
  Top Layer w0.4: MK2.20 15.55,18.51 13.17,16.13 13.17,2.67 J1.10
GPIO12: length 11.3
  Top Layer w0.4: J1.3 6.82,8.25 2.57,12.51 MK2.6
GPIO13: length 12.1
  Top Layer w0.4: MK2.7 2.92,10.51 3.77,9.65 3.77,8.25 5.55,6.48 5.55,2.54 6.69,1.4 J1.4
GPIO14: length 17.3
  Top Layer w0.4: J1.6 8.09,2.67 8.09,9.65 3.23,14.51 MK2.5
GPIO15: length 1.2
  Top Layer w0.8: v1(16.35,10.54) 17.08,10.54
  Bottom Layer w0.8: v1(16.35,10.54) 16.22,10.41 R3.2
RST: length 20.6
  Top Layer w0.8: v1(2.92,22.48) 2.89,22.51 MK2.1 ; v1(0.85,6.35) 0.85,5.66 RST.2
  Bottom Layer w0.8: v1(2.92,22.48) 1.36,22.48 0.85,21.97 v1(0.85,6.35)
RXD: length 19.7
  Top Layer w0.4: MK2.21 17.05,20.57 15.58,20.57 11.9,16.89 J1.7
TXD: length 25.3
  Top Layer w0.4: MK2.22 15.49,22.51 10.63,17.65 10.63,2.67 J1.8

## Copper pours and planes (outline as drawn; the poured copper is in the pictures)
GND on Bottom Layer: 7.2,17.27 7.2,14.24 7.19,14.22 2.5,14.22 2.5,8.13 2.49,2.67 0.22,2.67 0.22,0.25 0.23,0.24 5.42,0.24 5.42,11.05 13.17,11.05 13.17,6.15 15.46,6.1 15.46,0.38 18.38,0.38 18.38,10.03 15.58,10.03 15.58,17.27

## Text on the board
Bottom Silkscreen Layer: GND | +5V | IO12 | IO13 | ADC | IO14 | RXD | TXD | IO5 | IO4
Top Silkscreen Layer: +5V | GND | IO13 | IO12 | ADC | IO14 | RXD | TXD | IO4 | IO5

# Board PCB2
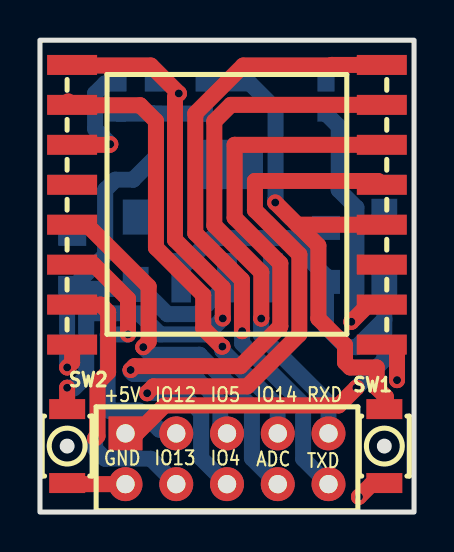
[diagram p7: board, top side]
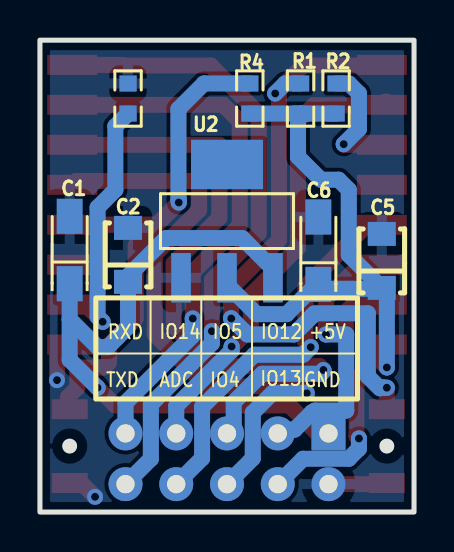
[diagram p8: board, bottom side, seen from below]

Outline 18.72 x 23.62 mm; copper layers: Top Layer, Bottom Layer. Coordinates in mm from the lower left corner of the outline.
Outline path: rectangle 0,23.62 18.72,0
Stack: Top Layer 0.035mm / Dielectric1 1.51mm FR4 er 4.5 / Bottom Layer 0.035mm

## Design rules (mm)
spacing safeClearance (default): track to track 0.152, other pairs 0.152 to 0.3
track width trackWidth (default): min 0.127, default 0.8, max 2.54
differential pair differentialPair (default): width min 0.127, default 0.254, max 2.54; gap min 0.152, default 0.152
via viaSize (default): diameter min 0.5, default 0.8, max 10; hole min 0.3, default 0.4, max 6

## Placement (name value [footprint] x y rotation side)
C1  10uF  [CAP-SMD_L3.2-W1.6-RD]  17.24 13.12 90 bottom
C2  100nF  [CAP-SMD_L3.2-W1.6]  14.31 12.87 90 bottom
C5  100nF  [CAP-SMD_L3.2-W1.6]  1.61 12.57 90 bottom
C6  10uF  [CAP-SMD_L3.2-W1.6-RD]  4.79 13.08 90 bottom
J1  HDR-M-2.54_1x10  [HDR-TH_10P-P2.54-V-F-R2-C5-S2.54-4]  9.36 2.67 0 top
MK1  ESP-12E  [WIFIM-SMD_ESP-12E]  9.36 14.64 0 top
R1  10kΩ  [R0603]  5.68 20.7 270 bottom
R2  10kΩ  [R0603]  3.9 20.7 270 bottom
R3  10kΩ  [R0603]  14.31 20.7 90 bottom
R4  10kΩ  [R0603]  8.22 20.7 90 bottom
SW1  TS-1064S-A1B2-D4  [KEY-SMD_L3.0-W2.5-LS4.0]  17.24 3.3 90 top
SW2  TS-1064S-A1B2-D4  [KEY-SMD_L3.0-W2.5-LS4.0]  1.36 3.3 90 top
U2  AMS1117-3.3S  [SOT-223-4_L6.5-W3.5-P2.30-LS7.0-BL]  9.36 14.56 180 bottom

## Footprints (pads in the part's own frame, mm; a bottom-side part is the same pattern mirrored in y, then rotated)
CAP-SMD_L3.2-W1.6
  rect 1.2x1.4 smd: 1(-1.35,0) 2(1.35,0)
CAP-SMD_L3.2-W1.6-RD
  rect 1.758x1.296 smd: 1(-1.687,0) 2(1.687,0)
HDR-TH_10P-P2.54-V-F-R2-C5-S2.54-4
  rect 1.7x1.7 hole 0.914: 1(-5.08,1.27)
  round 1.7 hole 0.914: 2(-5.08,-1.27) 3(-2.54,1.27) 4(-2.54,-1.27) 5(0,1.27) 6(0,-1.27) 8(2.54,1.27) 8(2.54,-1.27) 9(5.08,1.27) 10(5.08,-1.27)
KEY-SMD_L3.0-W2.5-LS4.0
  rect 1x1.8 smd: 1(-1.85,0) 2(1.85,0)
R0603
  rect 0.806x0.864 smd: 1(-0.753,0) 2(0.753,0)
SOT-223-4_L6.5-W3.5-P2.30-LS7.0-BL
  rect 0.98x2.47 smd: 1(-2.3,-2.835) 2(0,-2.835) 3(2.3,-2.835)
  rect 3.6x2.47 smd: 4(0,2.835)
WIFIM-SMD_ESP-12E
  rect 2.5x1 smd: 1(-7.75,7.74) 2(-7.75,5.74) 3(-7.75,3.74) 4(-7.75,1.74) 5(-7.75,-0.26) 6(-7.75,-2.26) 7(-7.75,-4.26) 8(-7.75,-6.26) 15(7.75,-6.26) 16(7.75,-4.26) 17(7.75,-2.26) 18(7.75,-0.26) 19(7.75,1.74) 20(7.75,3.74) 21(7.75,5.74) 22(7.75,7.74)

## Nets
As in the schematic.

Pads without a net: MK1 4 17; U2 4

## Via types
v1: diameter 0.8, hole 0.4, Top Layer to Bottom Layer, 19 vias

## Routing (per net, layer and track width the routed paths; a pad name or vN(x,y) marks a point on that pad's centre or on a via; arc(x,y) is an arc through that point)
$1N491: length 32.6
  Top Layer w0.8: v1(9.15,9.69) 9.15,11.23 6.76,13.63 6.76,20.76 v1(6.95,20.95) 5.55,22.35 1.64,22.35 MK1.1 ; v1(1.36,6.22) 1.36,5.24 1.24,5.12
  Bottom Layer w0.8: 1.71,6.19 2.31,6.79 2.31,9.95 4.99,9.95 ; v1(6.95,20.95) 6.45,21.45 R1.1 ; 5.1,9.82 5.1,9.8 6.02,8.89 8.34,8.89 9.15,9.7 9.16,9.7 ; 5.1,9.82 5.12,9.82 ; 5.1,9.82 5.1,9.83 ; 1.55,6.22 1.53,6.22 ; 1.53,6.22 1.55,6.24 ; 1.53,6.22 v1(1.36,6.22)
$1N492: length 13
  Top Layer w0.8: MK1.16 16.44,10.38 v1(15.58,9.52)
  Bottom Layer w0.8: v1(15.58,9.52) 15.84,9.78 15.84,15.24 14.95,16.13 14.95,19.31 R3.1
$1N493: length 6.1
  Top Layer w0.8: MK1.3 3.49,18.38 v1(3.52,18.41)
  Bottom Layer w0.8: v1(3.52,18.41) 2.76,19.18 2.76,20.95 3.26,21.45 R2.1
$1N496: length 32.7
  Top Layer w0.8: MK1.20 9.74,18.38 9.74,14.73 12.03,12.45 12.03,9.29 10.04,7.3 4.73,7.3 v1(4.54,7.11)
  Bottom Layer w0.8: J1.5 9.02,4.28 9.02,5.49 7.6,6.92 4.67,6.92 4.52,7.07
$1N497: length 31.1
  Top Layer w0.8: v1(5.37,5.95) 5.37,5.98 5.68,6.29 10.37,6.29 12.98,8.9 12.98,12.89 10.76,15.11 10.76,16.57 16.92,16.57 MK1.19
  Bottom Layer w0.8: 5.41,5.97 7.07,5.97 8.07,4.97 8.07,2.69 J1.6
$1N498: length 13.9
  Top Layer w0.8: 4.41,9 4.41,10.67 2.69,12.38 MK1.6
  Bottom Layer w0.8: 6.9,4.07 6.84,4.13 5.97,4.13 5.1,5 5.05,5 4.96,5.08 3.39,5.08 3.39,8.89 v1(4.41,8.89)
$1N499: length 13.9
  Top Layer w0.8: MK1.7 3.04,10.38 3.41,10.01 3.41,7 2.88,6.47 2.88,3.8 v1(2.76,3.68)
  Bottom Layer w0.8: J1.4 5.55,2.67 3.27,2.67 2.76,3.17 v1(2.76,3.68)
$1N500: length 23
  Top Layer w0.8: v1(9.13,8.29) 9.09,8.29 8.17,9.2 8.17,10.87 5.81,13.23 5.81,19.58 5.02,20.36 1.61,20.36 1.41,20.56 ; J1.8 v1(11.9,4.05) 11.9,4.06
  Bottom Layer w0.8: v1(9.13,8.29) 9.13,8.08 11.9,5.31 v1(11.9,4.05)
$1N501: length 19.3
  Top Layer w0.8: MK1.5 2.34,14.38 5.44,11.29 5.44,8.52 v1(5.17,8.25)
  Bottom Layer w0.8: v1(5.17,8.25) 5.55,7.87 7.99,7.87 10.61,5.26 10.61,2.69 11.9,1.4
$1N502: length 26.7
  Top Layer w0.8: MK1.21 9.55,20.38 8.73,19.56 8.73,14.35 11.08,12 11.08,9.69 v1(11.07,9.69)
  Bottom Layer w0.8: J1.9 14.44,5.47 11.07,8.83 v1(11.07,9.69)
$1N503: length 31.7
  Top Layer w0.8: MK1.22 14.61,22.38 14.58,22.35 10.17,22.35 7.77,19.95 7.77,13.96 10.11,11.62 10.11,9.06 v1(10.12,9.05)
  Bottom Layer w0.8: v1(10.12,9.05) 10.12,8.44 13.17,5.39 13.17,2.67 J1.10
$1N1406: length 7.3
  Top Layer w0.8: v1(17.87,6.6) 17.87,8.2 17.69,8.38 MK1.15 ; v1(15.97,0.76) 16.58,1.37 17.48,1.37 ; 4.28,1.4 2.12,1.4 2.1,1.42 1.24,1.42
$1N1442: length 29.9
  Top Layer w0.8: v1(1.36,7.24) 1.61,7.49 MK1.8
  Bottom Layer w0.8: R1.2 R4.1 ; R1.2 R2.2 ; R1.2 5.81,19.82 5.81,17.78 4.66,16.64 3.77,16.64 3.27,16.13 3.27,12.87 C5.1 ; C5.1 1.66,11.18 5.11,11.18 6.38,9.91 7.88,9.91 9.36,11.39 U2.2 ; C5.1 1.36,10.97 v1(1.36,7.24)
$1N1456: length 33.6
  Top Layer w0.8: 4.28,3.94 4.84,3.94 6.24,5.34 14.96,5.34 v1(15.84,6.22)
  Bottom Layer w0.8: 7.06,11.73 7.06,12.18 8.6,13.72 12.41,13.72 14.31,11.81 14.31,9.27 15.33,8.25 15.84,8.25 17.24,9.65 ; 17.24,9.65 17.24,7.62 v1(15.84,6.22) ; 17.24,9.65 17.24,11.11
$1N1746: length 26.5
  Top Layer w0.8: SW1.2 17.31,5.23 17.31,5.76 16.85,6.22 16.85,7.24 15.52,7.24 15.27,7.49 15.27,8.35 13.93,9.69 13.93,13.33 12.89,14.38 ; 12.89,14.38 MK1.18 ; 12.89,14.38 v1(11.77,15.49)
  Bottom Layer w0.8: R4.2 10.51,21.45 11.79,20.18 11.79,15.64 11.77,15.62 v1(11.77,15.49)

## Copper pours and planes (outline as drawn; the poured copper is in the pictures)
$1N1406 on Bottom Layer: -0.04,23.7 18.77,23.7 18.77,0 -0.04,0

## Text on the board
Bottom Silkscreen Layer: +5V | GND | IO12 | IO13 | IO5 | IO4 | IO14 | ADC | RXD | TXD
Top Silkscreen Layer: +5V | GND | IO13 | IO12 | IO5 | IO4 | IO14 | ADC | RXD | TXD
